# EAGLE design light_switch_smd3 (EAGLE 9.5.2)
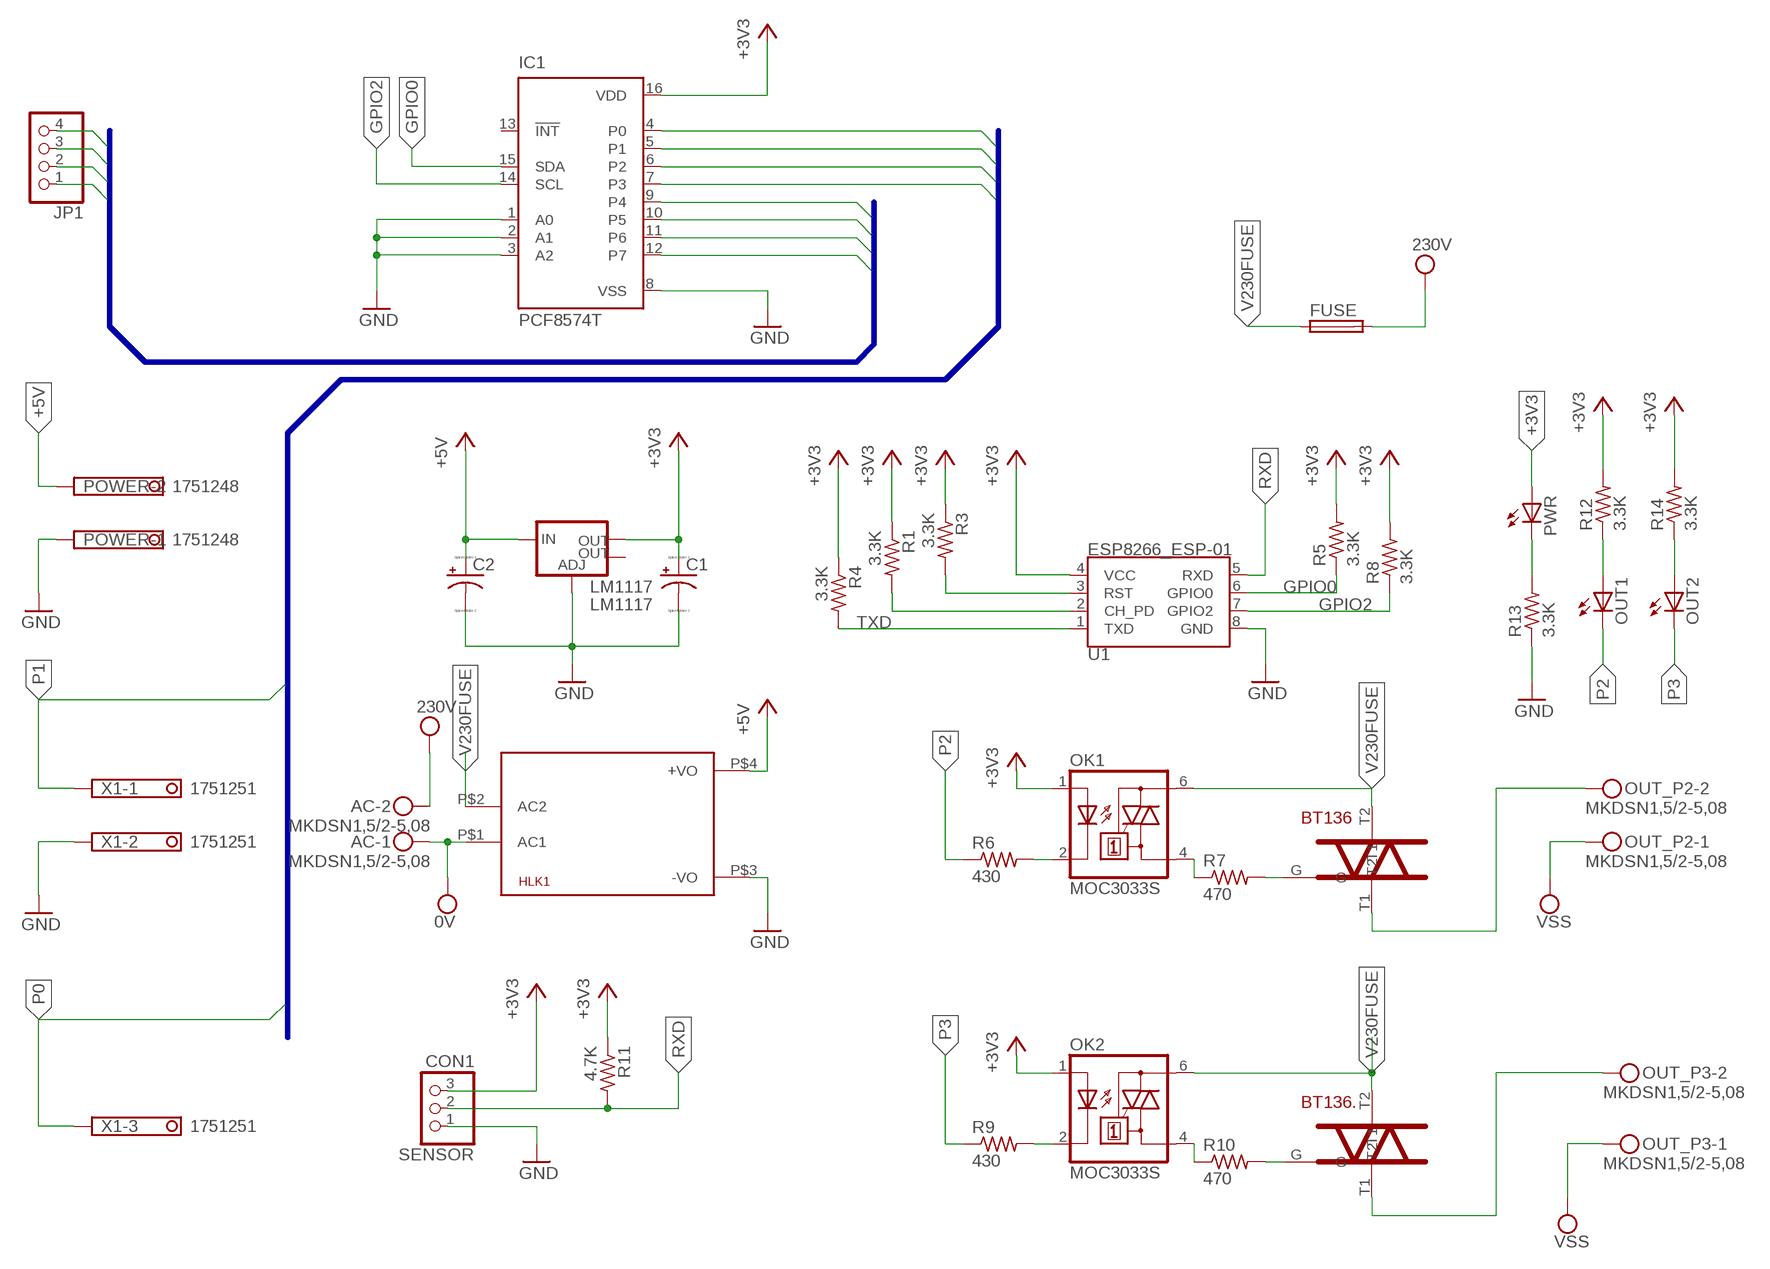
[diagram p0: schematic, sheet 1]

## Parts
AC  MKDSN1,5/2-5,08  [MKDSN1,5/2-5,08]
BT136  BT136  [BT136-PKG]
BT136.  BT136  [BT136-PKG]
C1  10uF  CPOL-USA/3216-18R  [A/3216-18R]
C2  10uF  CPOL-USA/3216-18R  [A/3216-18R]
FUSE  TE5  [TE5]
HLK1  HLK-PM013W  [HLK-PM01]
IC1  PCF8574T  [SO16W]
JP1  PINHD-1X4  [1X04]
LM1117  LM1117  V_REG_LM1117SOT223  [SOT223]
OK1  MOC3033S  [DIL6-SMD]
OK2  MOC3033S  [DIL6-SMD]
OUT1  LEDSML1206  [SML1206]
OUT2  LEDSML1206  [SML1206]
OUT_P2  MKDSN1,5/2-5,08  [MKDSN1,5/2-5,08]
OUT_P3  MKDSN1,5/2-5,08  [MKDSN1,5/2-5,08]
POWER  1751248  [1751248]
PWR  LEDSML1206  [SML1206]
R1  3.3K  R-US_R1206  [R1206]
R3  3.3K  R-US_R1206  [R1206]
R4  3.3K  R-US_R1206  [R1206]
R5  3.3K  R-US_R1206  [R1206]
R6  430  R-US_R1206  [R1206]
R7  470  R-US_R1206  [R1206]
R8  3.3K  R-US_R1206  [R1206]
R9  430  R-US_R1206  [R1206]
R10  470  R-US_R1206  [R1206]
R11  4.7K  R-US_R1206  [R1206]
R12  3.3K  R-US_R1206  [R1206]
R13  3.3K  R-US_R1206  [R1206]
R14  3.3K  R-US_R1206  [R1206]
SENSOR  CON1  PINHD-1X3  [1X03]
U1  ESP8266_ESP-01  [ESP8266_ESP-01]
X1  1751251  [1751251]

## Nets
+3V3: C1.+ IC1.16(VDD) LM1117.2(OUT) OK1.1(A) OK2.1(A) PWR.A R1.1 R3.1 R4.1 R5.2 R8.2 R11.1 R12.2 R14.2 SENSOR.3 U1.4(VCC)
+5V: C2.+ HLK1.P$4(+VO) LM1117.3(IN) POWER.2
CH_PD: R1.2 U1.2(CH_PD)
GND: C1.- C2.- HLK1.P$3(-VO) IC1.1(A0) IC1.2(A1) IC1.3(A2) IC1.8(VSS) LM1117.1(ADJ) POWER.1 R13.1 SENSOR.1 U1.8(GND) X1.2
GPIO0: IC1.15(SDA) R5.1 U1.6(GPIO0)
GPIO2: IC1.14(SCL) R8.1 U1.7(GPIO2)
N$1: PWR.C R13.2
N$2: OK2.2(C) R9.2
N$3: OK2.4(A1) R10.1
N$4: BT136.T1 OUT_P2.2
N$5: OK1.2(C) R6.2
N$6: BT136.G R7.2
N$7: OK1.4(A1) R7.1
N$8: BT136..T1 OUT_P3.2
N$9: OUT1.A R12.1
N$11: OUT2.A R14.1
N$14: BT136..G R10.2
P0: IC1.4(P0) X1.3
P1: IC1.5(P1) X1.1
P2: IC1.6(P2) OUT1.C R6.1
P3: IC1.7(P3) OUT2.C R9.1
P4: IC1.9(P4) JP1.1
P5: IC1.10(P5) JP1.2
P6: IC1.11(P6) JP1.3
P7: IC1.12(P7) JP1.4
RST: R3.2 U1.3(RST)
RXD: R11.2 SENSOR.2 U1.5(RXD)
TXD: R4.2 U1.1(TXD)
V230FUSE: BT136..T2 BT136.T2 FUSE.1 HLK1.P$2(AC2) OK1.6(A2) OK2.6(A2)
VPP: AC.2 FUSE.2 ; supply symbol labelled 230V
VSS: AC.1 HLK1.P$1(AC1) OUT_P2.1 OUT_P3.1 ; supply symbol labelled 0V
Unconnected: IC1.13(!INT) LM1117.4(OUT)

## Buses
P0,P1,P2,P3
P4,P5,P6,P7

## Library data of the parts
AC OUT_P2 OUT_P3 = con-phoenix-508:MKDSN1,5/2-5,08: MKDSN 1,5/ 2-5,08 Printklemme Nennstrom: 13,5 A Nennspannung: 250 V Rastermaß: 5,08 mm Polzahl: 2 Anschlussart: Schraubanschluss Montage: Löten Anschlussrichtung Leiter/Platine: 0 ° Artikelnummer: 1729128 Source: http://eshop.phoenixcontact.com .. 1729128.pdf
BT136 BT136. = myblog_library:BT136
C1 C2 = resistor:CPOL-US: POLARIZED CAPACITOR, American symbol
FUSE = fuse:TE5: FUSE Wickmann; OC_FARNELL: unknown; OC_NEWARK: unknown
HLK1 = HLK-PM01:HLK-PM01: Hi-Link Power Supply HLK-PM01 3W Author: Ahmed Said <https://github.com/AhmedSaid/EAGLELibraries>
IC1 = micro-philips:PCF8574: I2C-Bus Remote 8-bit I/O expander http://www.semiconductors.philips.com/acrobat_download/datasheets/PCF8574_4.pdf; MPN: PCF8574T/3,512; OC_FARNELL: 1201255; OC_NEWARK: 70R6870
JP1 = pinhead:PINHD-1X4: PIN HEADER
LM1117 = SparkFun-PowerIC:V_REG_LM1117: Voltage Regulator LM1117 Standard adjustable voltage regulator but in SMD form. Spark Fun Electronics SKU : COM-00595; PROD_ID: VREG-08170
OK1 OK2 = optocoupler:MOC30*: 6-Pin DIP Zero-Cross Optoisolators Triac Driver Output (250/400 Volt Peak) Source: Data sheet <http://www.fairchildsemi.com/ds/MO/MOC3031M.pdf> The old path of data sheet not more available 2013-05-06.; MF: FAIRCHILD SEMICONDUCTOR; MPN: MOC3033S-M; OC_FARNELL: unknown; OC_NEWARK: 05C2878
OUT1 OUT2 PWR = led:LED: LED OSRAM: - CHIPLED LG R971, LG N971, LY N971, LG Q971, LY Q971, LO R971, LY R971 LH N974, LH R974 LS Q976, LO Q976, LY Q976 LO Q996 - Hyper CHIPLED LW Q18S LB Q993, LB Q99A, LB R99A - SideLED LS A670, LO A670, LY A670, LG A670, LP A670 LB A673, LV A673, LT A673, LW A673 LH A674 LY A675 LS A676, LA A676, LO A676, LY A676, LW A676 LS A679, LY A679, LG A679 - Hyper Micro SIDELED® LS Y876, LA Y876, LO Y876, LY Y876 LT Y87S - SmartLED LW L88C, LW L88S LB L89C, LB L89S, LG L890 LS L89K, LO L89K, LY L89K LS L896, LA L896, LO L896, LY L896 - TOPLED LS T670, LO T670, LY T670, LG T670, LP T670 LSG T670, LSP T670, LSY T670, LOP T670, LYG T670 LG T671, LOG T671, LSG T671 LB T673, LV T673, LT T673, LW T673 LH T674 LS T676, LA T676, LO T676, LY T676, LB T676, LH T676, LSB T676, LW T676 LB T67C, LV T67C, LT T67C, LS T67K, LO T67K, LY T67K, LW E67C LS E67B, LA E67B, LO E67B, LY E67B, LB E67C, LV E67C, LT E67C LW T67C LS T679, LY T679, LG T679 LS T770, LO T770, LY T770, LG T770, LP T770 LB T773, LV T773, LT T773, LW T773 LH T774 LS E675, LA E675, LY E675, LS T675 LS T776, LA T776, LO T776, LY T776, LB T776 LHGB T686 LT T68C, LB T68C - Hyper Mini TOPLED® LB M676 - Mini TOPLED Santana® LG M470 LS M47K, LO M47K, LY M47K Source: http://www.osram.convergy.de LUXEON: - LUMILED® LXK2-PW12-R00, LXK2-PW12-S00, LXK2-PW14-U00, LXK2-PW14-V00 LXK2-PM12-R00, LXK2-PM12-S00, LXK2-PM14-U00 LXK2-PE12-Q00, LXK2-PE12-R00, LXK2-PE12-S00, LXK2-PE14-T00, LXK2-PE14-U00 LXK2-PB12-K00, LXK2-PB12-L00, LXK2-PB12-M00, LXK2-PB14-N00, LXK2-PB14-P00, LXK2-PB14-Q00 LXK2-PR12-L00, LXK2-PR12-M00, LXK2-PR14-Q00, LXK2-PR14-R00 LXK2-PD12-Q00, LXK2-PD12-R00, LXK2-PD12-S00 LXK2-PH12-R00, LXK2-PH12-S00 LXK2-PL12-P00, LXK2-PL12-Q00, LXK2-PL12-R00 Source: www.luxeon.com KINGBRIGHT: KA-3528ASYC Source: www.kingbright.com
POWER = con-phoenix-350:1751248: MKDS 1/ 2-3,5 Printklemme Nennstrom: 10 A Bemessungsspannung: 160 V Raster: 3,5 mm Polzahl: 2 Montageart: Löten Anschlussart: Schraubanschluss Anschlussrichtung vom Leiter zur Platine: 0° Source: http://eshop.phoenixcontact.com .. 1751248.pdf; OC_FARNELL: unknown; OC_NEWARK: unknown
R1 R3-R14 = resistor:R-US_: RESISTOR, American symbol
SENSOR = pinhead:PINHD-1X3: PIN HEADER
U1 = SparkFun-RF:ESP8266_ESP-01: ESP8266 ESP-01 Module The ESP8266 WiFi Module is a self contained SOC with integrated TCP/IP protocol stack that can give any microcontroller access to your WiFi network. The ESP8266 is capable of either hosting an application or offloading all Wi-Fi networking functions from another application processor. Each ESP8266 module comes pre-programmed with an AT command set firmware, meaning, you can simply hook this up to your Arduino device and get about as much WiFi-ability as a WiFi Shield offers (and that’s just out of the box)! The ESP8266 module is an extremely cost effective board with a huge, and ever growing, community. This module has a powerful enough on-board processing and storage capability that allows it to be integrated with the sensors and other application specific devices through its GPIOs with minimal development up-front and minimal loading during runtime. Its high degree of on-chip integration allows for minimal external circuitry, including the front-end module, is designed to occupy minimal PCB area. The ESP8266 supports APSD for VoIP applications and Bluetooth co-existance interfaces, it contains a self-calibrated RF allowing it to work under all operating conditions, and requires no external RF parts. SparkFun Product Page <https://www.sparkfun.com/products/13678>; SF_ID: WRL-13678
X1 = con-phoenix-350:1751251: MKDS 1/ 3-3,5 Printklemme Nennstrom: 10 A Bemessungsspannung: 160 V Raster: 3,5 mm Polzahl: 3 Montageart: Löten Anschlussart: Schraubanschluss Anschlussrichtung vom Leiter zur Platine: 0° Source: http://eshop.phoenixcontact.com .. 1751251.pdf; OC_FARNELL: unknown; OC_NEWARK: unknown

## Net classes
0 default: width 0.152 mm, drill 0.305 mm, clearance 0.152 mm

## Board
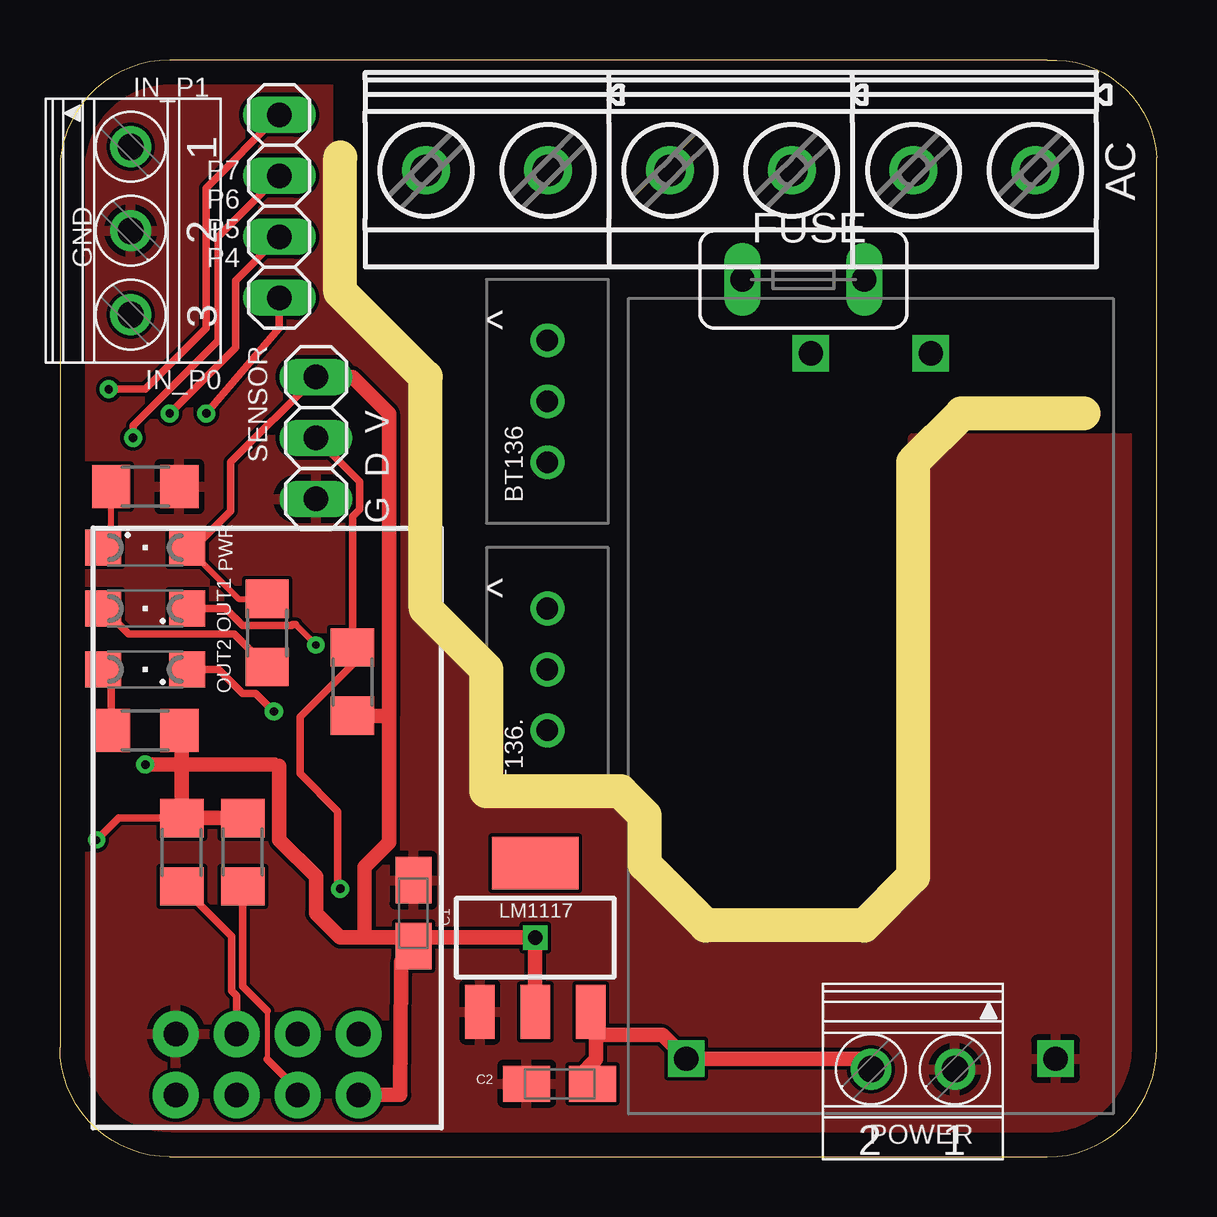
[diagram p1: board, top side]
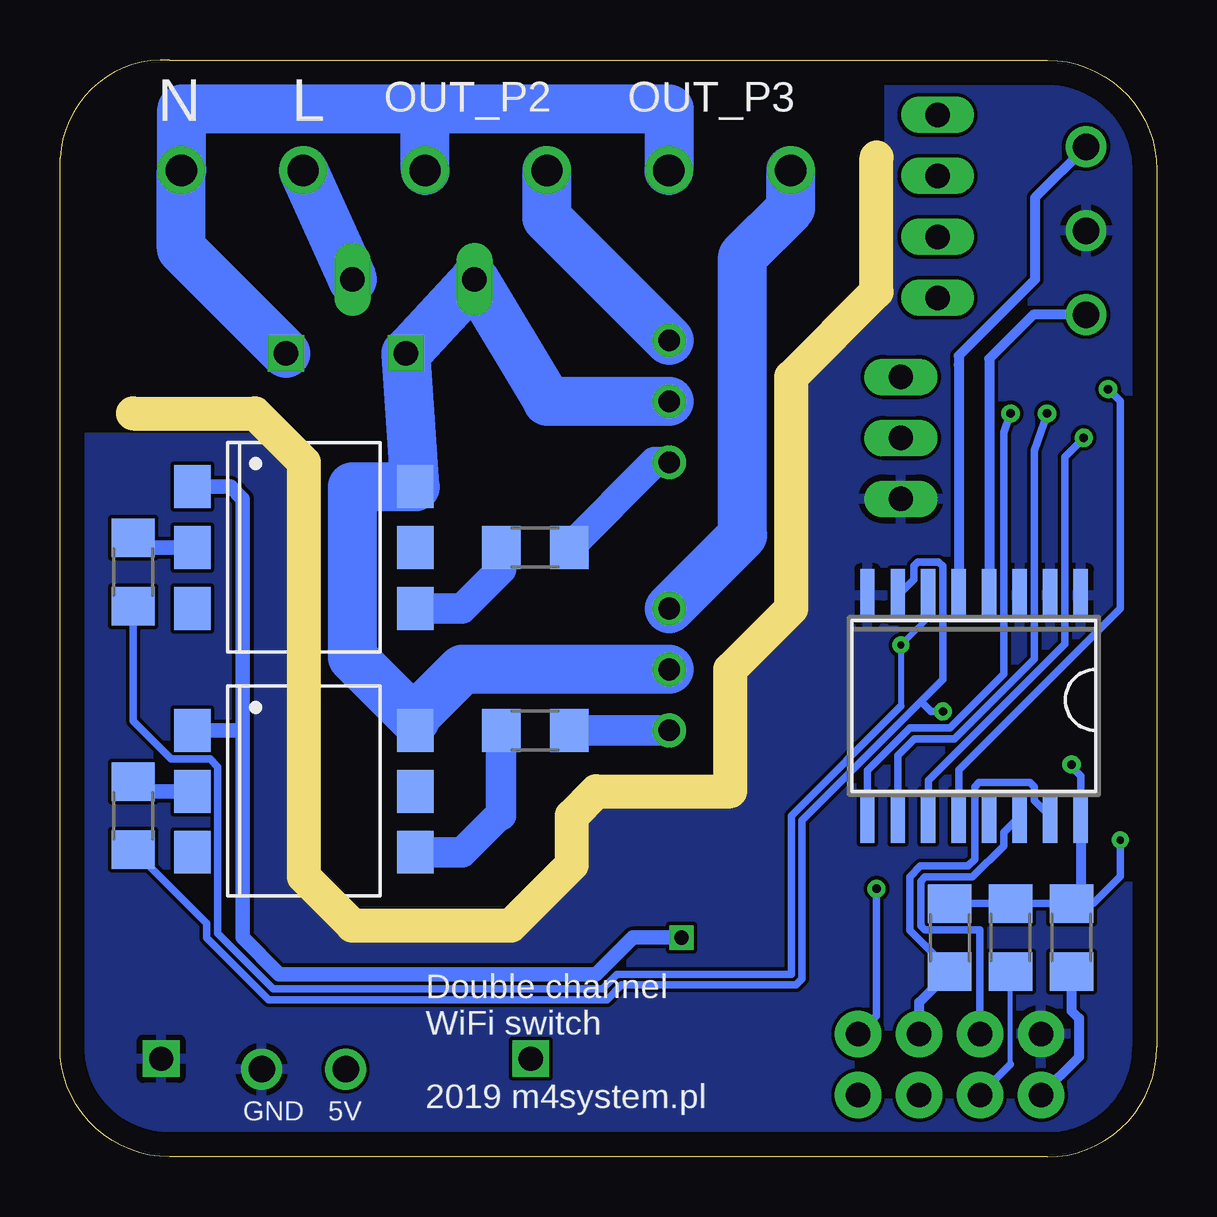
[diagram p2: board, bottom side, seen from below]

Size 45.72 x 45.73 mm. Coordinates in mm from the lower left corner, seen from the top.
Outline: 4.57,0 41.15,0 arc90 45.72,4.57 45.72,41.66 arc90 41.15,45.72 4.57,45.72 arc90 0,41.15 0,4.57 arc90 4.57,0
Copper layers (1*16): Top 0.035mm / dielectric 1.5mm / Bottom 0.035mm
Design rules "default *": minimum track width 6mil, minimum drill 12mil, track to track 6mil, track to pad 6mil, pad to pad 6mil, via to via 6mil, smd to smd 6mil, copper to edge 40mil, drill to drill 8mil, minimum pad ring 10mil, minimum via ring 8mil, stop-mask expansion 4mil, vias tented up to drill 0mil, thermal gap 10mil
Milling: 14 lines

### Footprints (pad centres in the part's own frame; a part is rotated, then mirrored left to right if it is on the bottom)
MKDSN1,5/2-5,08 = drill 1.3 pad 2: 1 -2.561,0.025; 2 2.519,0.025
BT136-PKG = drill 0.9: G 2.54,0; T1 -2.54,0; T2 0,0
A/3216-18R = smd 1.95 x 1.5: + 1.375,0; - -1.375,0
TE5 = drill 1.016 long: 1 -2.54,0; 2 2.54,0
HLK-PM01 = drill 1.016 square: P$1 -14.7,2.5; P$2 -14.7,-2.5; P$3 14.7,7.7; P$4 14.7,-7.7
SO16W = smd 0.6 x 2.2: 1 -4.445,-4.6; 2 -3.175,-4.6; 3 -1.905,-4.6; 4 -0.635,-4.6; 5 0.635,-4.6; 6 1.905,-4.6; 7 3.175,-4.6; 8 4.445,-4.6; 9 4.445,4.6; 10 3.175,4.6; 11 1.905,4.6; 12 0.635,4.6; 13 -0.635,4.6; 14 -1.905,4.6; 15 -3.175,4.6; 16 -4.445,4.6
1X04 = drill 1.016 long: 1 -3.81,0; 2 -1.27,0; 3 1.27,0; 4 3.81,0
SOT223 = smd 1.219 x 2.235: 1 -2.311,-3.099; 2 0,-3.099; 3 2.311,-3.099 | smd 3.6 x 2.2: 4 0,3.099
DIL6-SMD = smd 1.78 x 1.52: 1 -2.54,-4.645; 2 0,-4.645; 3 2.54,-4.645; 4 2.54,4.645; 5 0,4.645; 6 -2.54,4.645
SML1206 = smd 1.5 x 1.5: A 1.75,0; C -1.75,0
1751248 = drill 1.1 pad 1.7: 1 -1.75,-0.1; 2 1.75,-0.1
R1206 = smd 1.6 x 1.803: 1 -1.422,0; 2 1.422,0
1X03 = drill 1.016 long: 1 -2.54,0; 2 0,0; 3 2.54,0
ESP8266_ESP-01 = drill 1.016 pad 1.93: 1 -3.81,-11.13; 2 -1.27,-11.13; 3 1.27,-11.13; 4 3.81,-11.13; 5 3.81,-8.59; 6 1.27,-8.59; 7 -1.27,-8.59; 8 -3.81,-8.59
1751251 = drill 1.1 pad 1.7: 1 -3.5,-0.1; 2 0,-0.1; 3 3.5,-0.1

### Placement (x,y rotation side)
AC  38.1,41.15 180 top
BT136  20.32,31.5 270 top
BT136.  20.32,20.32 270 top
C1  14.73,10.16 270 top
C2  20.83,3.05 0 top
FUSE  30.99,36.58 0 top
HLK1  33.8,18.79 270 top
IC1  7.62,18.8 180 bottom
JP1  9.14,39.62 90 top
LM1117  19.81,9.14 0 top
OK1  35.56,25.4 270 bottom
OK2  35.56,15.24 270 bottom
OUT1  3.56,22.86 180 top
OUT2  3.56,20.32 180 top
OUT_P2  27.94,41.15 180 top
OUT_P3  17.78,41.15 180 top
POWER  35.56,3.56 180 top
PWR  3.56,25.4 0 top
R1  6.1,9.14 270 bottom
R3  7.62,12.7 270 top
R4  3.56,9.14 270 bottom
R5  8.64,9.14 90 bottom
R6  42.67,24.38 90 bottom
R7  25.91,25.4 0 bottom
R8  5.08,12.7 90 top
R9  42.67,14.22 90 bottom
R10  25.91,17.78 0 bottom
R11  12.19,19.81 90 top
R12  8.64,21.84 90 top
R13  3.56,27.94 180 top
R14  3.56,17.78 0 top
SENSOR  10.67,29.97 90 top
U1  8.64,13.72 0 top
X1  3.05,38.61 270 top

### Tracks (layer width: path | path; a pad name or v marks a point on that pad's centre or on a via)
+3V3  (via drill 0.3, 0.35, 0.6)
  Top 0.254: PWR.A 5.45,25.26 7.44,23.27 R12.2
  Top 0.305: SENSOR.3 7.11,28.96 7.11,26.92 5.45,25.26 | R8.2 2.44,14.12 v1.52,13.21 | 9.14,16.3 8.92,16.36 | R14.2 5.08,17.68
  Top 0.61: 14.73,9.14 v19.81,9.14 LM1117.2 | U1.4 14.18,2.59 14.22,7.62 14.22,8.13 14.73,9.14 | R3.1 R8.2 5.08,16.36 | 12.7,9.14 14.22,9.14 14.39,9.31 C1.+ 14.73,9.14 | SENSOR.3 12.19,32.51 13.72,30.99 13.72,18.39 | 13.72,18.39 13.72,13.11 12.7,12.09 12.7,9.14 | 13.72,18.39 R11.1 | v3.56,16.36 5.08,16.36 | 5.08,16.36 8.92,16.36 | 9.14,16.3 9.14,13.21 10.67,11.68 10.67,10.16 11.68,9.14 12.7,9.14 | 5.08,17.68 5.08,16.36
  Bottom 0.305: R5.2 R1.1 R4.1 2.64,10.57 1.52,11.68 v1.52,13.21 | v3.56,16.36 3.56,16.26 3.17,15.88 IC1.16
  Bottom 0.406: IC1.16 3.17,10.95 R4.1
  Bottom 0.61: OK1.1 38.61,27.94 38.1,27.43 38.1,17.78 | 38.1,17.78 38.1,9.14 36.58,7.62 23.37,7.62 21.84,9.14 v19.81,9.14 | OK2.1 38.1,17.78
+5V
  Top 0.61: LM1117.3 22.35,5.82 22.35,5.08 | 22.35,5.08 22.35,4.06 21.68,3.39 C2.+ | 22.35,5.08 25.11,5.08 HLK1.P$4 33.37,4.09 POWER.2
CH_PD
  Bottom 0.203: 6.1,3.86 R1.2
  Bottom 0.305: U1.2 6.1,3.86
GND
  pour Top: 0,45.72 11.18,45.72 11.18,36.07 15.24,32 15.24,22.86 17.78,20.32 17.78,14.73 23.37,14.73 24.38,13.72 24.38,11.68 26.42,9.65 33.53,9.65 35.56,11.68 35.56,29.97 46.23,29.97 46.23,-0.51 -0.51,-0.51 -1.02,0 -1.02,44.7
  pour Bottom: 0,45.72 11.18,45.72 11.18,36.07 15.24,32 15.24,23.37 18.29,20.32 18.29,15.24 22.35,15.24 24.89,12.7 24.89,11.68 26.92,9.65 33.53,9.65 35.56,11.68 35.56,28.45 37.08,29.97 46.23,29.97 46.23,-0.51 -0.51,-0.51 -1.02,0 -1.02,44.7
GPIO0
  Bottom 0.305: IC1.15 5.11,14.86 5.11,15.42 5.29,15.6 7.41,15.6 7.59,15.42 7.59,12.41 7.87,12.13 9.85,12.13 10.3,11.68 10.3,9.45 8.64,7.79 R5.1
  Bottom 0.406: U1.6 9.91,6.45 R5.1
GPIO2
  Top 0.305: R8.1 7.16,9.2 7.16,6.92 7.37,6.72 U1.7
  Bottom 0.305: IC1.14 6.38,13.53 6.38,12.97 7.68,11.67 9.66,11.67 9.84,11.49 9.84,9.64 9.66,9.46 7.37,9.46 U1.7
N$1
  Top 0.254: PWR.C 2.13,25.73 R13.2
N$2
  Bottom 0.61: R9.2 42.51,15.24 OK2.2
N$3
  Bottom 1.27: R10.1 27.33,14.23 27.44,14.21 28.96,12.7 OK2.4
N$4
  Bottom 2.032: BT136.T1 25.42,39.14 OUT_P2.2
N$5
  Bottom 0.61: R6.2 42.51,25.4 OK1.2
N$6
  Bottom 1.27: R7.2 20.93,28.96 BT136.G
N$7
  Bottom 1.27: OK1.4 28.96,22.86 27.33,24.49 R7.1
N$8
  Bottom 2.032: BT136..T1 17.27,25.91 17.27,37.55 15.26,39.56 OUT_P3.2
N$9
  Top 0.305: OUT1.A 2.86,21.8 7.25,21.8 R12.1
N$11
  Top 0.305: OUT2.A 2.13,19.99 R14.1
N$14
  Bottom 1.27: R10.2 BT136..G
P0
  Bottom 0.406: IC1.4 6.99,33.27 5.15,35.11 X1.3
P1
  Bottom 0.406: IC1.5 8.26,33.02 8.26,33.4 5.08,36.58 5.08,39.98 X1.1
P2  (via drill 0.3)
  Top 0.254: v10.67,21.34 9.82,22.19
  Top 0.305: 9.82,22.19 9.69,22.19 9.66,22.16 7.61,22.16 6.91,22.86 OUT1.C
  Bottom 0.254: 10.67,18.8 v10.67,21.34 9.53,22.48 IC1.6
  Bottom 0.305: R6.1 42.67,18.17 41.09,16.59 39.47,16.59 39.14,16.26 39.14,9.32 36.83,7.01 23.11,7.01 22.51,7.62 15.24,7.62 15.24,14.22 10.67,18.8
P3  (via drill 0.35)
  Top 0.305: v8.91,18.57 8.16,19.32 7.61,19.32 6.61,20.32 OUT2.C
  Bottom 0.305: IC1.7 10.13,24.06 10.13,24.62 9.95,24.8 9.1,24.8 8.92,24.62 8.92,19.9 9.84,18.98 | 9.84,18.98 14.78,14.04 14.78,7.43 15.05,7.16 22.32,7.16 22.93,6.55 37.02,6.55 39.6,9.13 39.6,9.73 R9.1 | v8.91,18.57 9.42,18.57 9.84,18.98
P4  (via drill 0.35)
  Top 0.305: JP1.1 9.14,34.54 v6.1,30.99
  Bottom 0.305: IC1.9 12.06,16.11 10.29,17.88 8.63,17.88 6.38,20.14 6.38,30.2 v6.1,30.99
P5  (via drill 0.35)
  Top 0.305: JP1.2 7.32,36.52 7.32,33.73 v4.57,30.99
  Bottom 0.305: v4.57,30.99 5.11,29.43 5.11,20.76 8.44,17.43 10.1,17.43 10.79,16.73 IC1.10
P6  (via drill 0.35)
  Top 0.305: JP1.3 6.6,38.35 6.6,34.04 3.05,30.48 v3.05,29.97
  Bottom 0.305: IC1.11 9.53,15.7 3.84,21.38 3.84,29.18 v3.05,29.97
P7  (via drill 0.35)
  Top 0.305: JP1.4 6.1,40.39 6.1,34.54 3.56,32 v2.03,32
  Bottom 0.305: v2.03,32 1.52,31.5 1.52,22.86 8.26,16.13 IC1.12
RST
  Top 0.203: 8.64,6.1 8.64,4.06
  Top 0.305: R3.2 7.62,7.11 8.64,6.1 | 8.64,4.06 9.91,2.79 U1.3
RXD  (via drill 0.35)
  Top 0.305: SENSOR.2 12.5,28.14 12.5,26.99 12.19,26.68 R11.2 12.19,20.52 10.01,18.34 10.01,15.98 11.58,14.41 11.58,11.28 v11.68,11.18
  Bottom 0.305: v11.68,11.18 11.68,5.89 U1.5
TXD
  Bottom 0.406: R4.2 3.56,6.08 3.25,5.78 3.25,4.16 U1.1
V230FUSE
  Bottom 1.27: 30.91,18.21 OK2.6
  Bottom 1.422: OK2.6 30.91,18.36
  Bottom 2.032: BT136..T2 28.96,20.32 30.91,18.36 | 30.91,18.21 33.53,20.83 33.53,27.94 OK1.6 HLK1.P$2 FUSE.1 25.4,31.5 BT136.T2
VPP
  Bottom 2.032: AC.2 FUSE.2
VSS
  Bottom 1.27: AC.1 40.64,41.14
  Bottom 2.032: 40.64,41.14 40.64,43.69 30.48,43.69 | HLK1.P$1 40.66,37.85 AC.1 | 30.48,43.69 20.32,43.69 20.34,43.67 OUT_P3.1 | OUT_P2.1 30.5,43.67 30.48,43.69

### Text on the board
tNames: IN_P1 | GND | P7 / P6 / P5 / P4 | IN_P0 | G D V
bNames: L | N | Double channel / WiFi switch / / 2019 m4system.pl | 5V | GND